# Altium schematic sheet 10_POWER.SchDoc: DCDC Power Supply / Misc.
size 381 x 266 mm; Organization: Meteroi; Address1: Room 428, 410 Guiping Rd.; Address2: Shanghai 200233, CHINA; SheetNumber: 11; SheetTotal: 11; PageSetup: Record=PageOptions|CenterHorizontal=True|CenterVertical=True|PrintScale=0.75|XCorrection=1.00|YCorrection=1.00|PrintKind=2|BorderSize=5000000|LeftOffset=0|BottomOffset=0|Orientation=2|PaperLength=1000|PaperWidth=1000|Scale=100|PaperSource=276|PrintQuality=-3|MediaType=1|DitherType=10|PaperKind=A4|PrintScaleMode=1
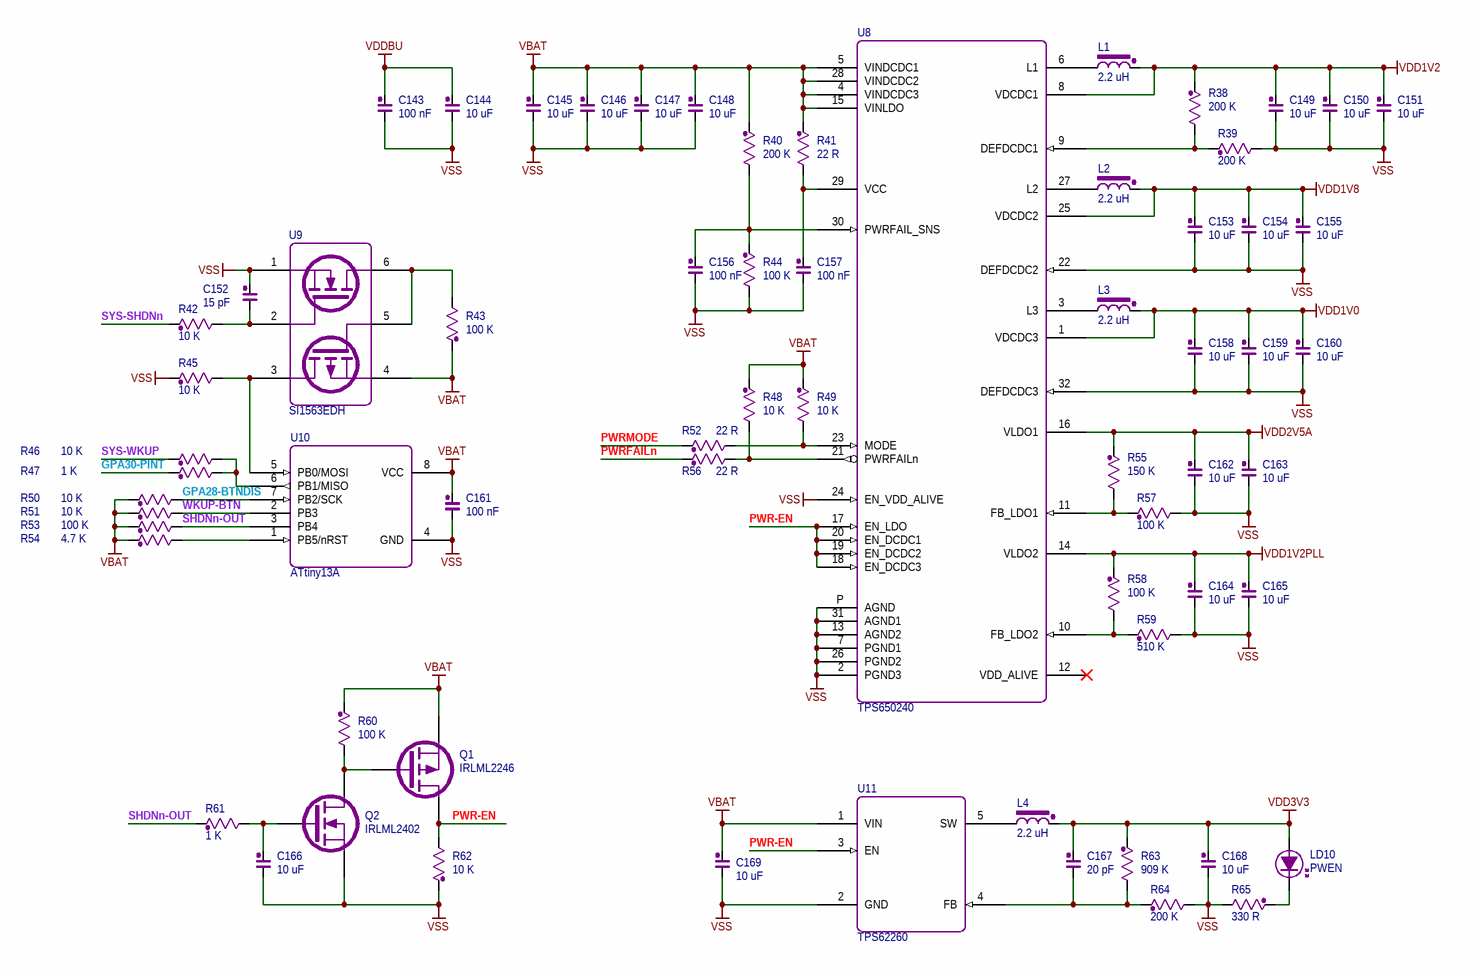
[diagram p0: 10_POWER.SchDoc]

## Parts
C143  100 nF  [0402A1]
C144  10 uF  [0603A1]
C145  10 uF  [0603A1]
C146  10 uF  [0603A1]
C147  10 uF  [0603A1]
C148  10 uF  [0603A1]
C149  10 uF  [0603A1]
C150  10 uF  [0603A1]
C151  10 uF  [0603A1]
C152  15 pF  [0402A1]
C153  10 uF  [0603A1]
C154  10 uF  [0603A1]
C155  10 uF  [0603A1]
C156  100 nF  [0402A1]
C157  100 nF  [0402A1]
C158  10 uF  [0603A1]
C159  10 uF  [0603A1]
C160  10 uF  [0603A1]
C161  100 nF  [0402A1]
C162  10 uF  [0603A1]
C163  10 uF  [0603A1]
C164  10 uF  [0603A1]
C165  10 uF  [0603A1]
C166  10 uF  [0603A1]
C167  20 pF  [0402A1]
C168  10 uF  [0603A1]
C169  10 uF  [0603A1]
L1  2.2 uH  [COIL_S_3X3]
L2  2.2 uH  [COIL_S_3X3]
L3  2.2 uH  [COIL_S_3X3]
L4  2.2 uH  [COIL_S_3X3]
LD10  PWEN  [0603LD]
Q1  IRLML2246  [SOT-23-3]
Q2  IRLML2402  [SOT-23-3]
R38  200 K  [0402A2]
R39  200 K  [0402A2]
R40  200 K  [0402A2]
R41  22 R  [0402A2]
R42  10 K  [0402A2]
R43  100 K  [0402A2]
R44  100 K  [0402A2]
R45  10 K  [0402A2]
R46  10 K  [0402A2]
R47  1 K  [0402A2]
R48  10 K  [0402A2]
R49  10 K  [0402A2]
R50  10 K  [0402A2]
R51  10 K  [0402A2]
R52  22 R  [0402A2]
R53  100 K  [0402A2]
R54  4.7 K  [0402A2]
R55  150 K  [0402A2]
R56  22 R  [0402A2]
R57  100 K  [0402A2]
R58  100 K  [0402A2]
R59  510 K  [0402A2]
R60  100 K  [0402A2]
R61  1 K  [0402A2]
R62  10 K  [0402A2]
R63  909 K  [0402A2]
R64  200 K  [0402A2]
R65  330 R  [0402A2]
U8  TPS650240  [QFN-5-32]
U9  SI1563EDH  [SOT-363]
U10  ATtiny13A  [SOIC-8W]
U11  TPS62260  [SOT-23-5]

## Nets
VBAT: C145.2 C146.2 C147.2 C148.2 C161.2 C169.2 Q1.3(S) R40.2 R41.2 R43.2 R48.2 R49.2 R50.2 R51.2 R53.2 R54.2 R60.2 U8.4(VINDCDC3) U8.5(VINDCDC1) U8.15(VINLDO) U8.28(VINDCDC2) U9.4 U10.8(VCC) U11.1(VIN)
VDD1V0: C158.2 C159.2 C160.2 L3.2 U8.1(VDCDC3)
VDD1V2: C149.2 C150.2 C151.2 L1.2 R38.2 U8.8(VDCDC1)
VDD1V2PLL: C164.2 C165.2 R58.2 U8.14(VLDO2)
VDD1V8: C153.2 C154.2 C155.2 L2.2 U8.25(VDCDC2)
VDD2V5A: C162.2 C163.2 R55.2 U8.16(VLDO1)
VDD3V3: C167.2 C168.2 L4.2 LD10.2 R63.2
VDDBU: C143.2 C144.2
VSS: C143.1 C144.1 C145.1 C146.1 C147.1 C148.1 C149.1 C150.1 C151.1 C152.2 C153.1 C154.1 C155.1 C156.1 C157.1 C158.1 C159.1 C160.1 C161.1 C162.1 C163.1 C164.1 C165.1 C166.1 C168.1 C169.1 Q2.3(S) R39.1 R44.1 R45.2 R57.1 R59.1 R62.2 R64.1 R65.1 U8.2(PGND3) U8.7(PGND1) U8.13(AGND2) U8.22(DEFDCDC2) U8.24(EN_VDD_ALIVE) U8.26(PGND2) U8.31(AGND1) U8.32(DEFDCDC3) U8.P(AGND) U9.1 U10.4(GND) U11.2(GND)
GPA28-BTNDIS: R50.1 U10.7(PB2/SCK)
GPA30-PINT: R47.2
PWR-EN: Q1.2(D) R62.1 U8.17(EN_LDO) U8.18(EN_DCDC3) U8.19(EN_DCDC2) U8.20(EN_DCDC1) U11.3(EN)
PWRFAILn: R56.2
PWRMODE: R52.2
SHDNn-OUT: R53.1 R61.2 U10.3(PB4)
SYS-SHDNn: R42.2
SYS-WKUP: R46.2
WKUP-BTN: R51.1 U10.2(PB3)
NetC152_1: C152.1 R42.1 U9.2
NetC156_2: C156.2 R40.1 R44.2 U8.30(PWRFAIL_SNS)
NetC157_2: C157.2 R41.1 U8.29(VCC)
NetC166_2: C166.2 Q2.1(G) R61.1
NetC167_1: C167.1 R63.1 R64.2 U11.4(FB)
NetL1_1: L1.1 U8.6(L1)
NetL2_1: L2.1 U8.27(L2)
NetL3_1: L3.1 U8.3(L3)
NetL4_1: L4.1 U11.5(SW)
NetLD10_1: LD10.1 R65.2
NetQ1_1: Q1.1(G) Q2.2(D) R60.1
NetR38_1: R38.1 R39.2 U8.9(DEFDCDC1)
NetR43_1: R43.1 U9.5 U9.6
NetR45_1: R45.1 U9.3 U10.5(PB0/MOSI)
NetR46_1: R46.1 R47.1 U10.6(PB1/MISO)
NetR48_1: R48.1 R56.1 U8.21(PWRFAILn)
NetR49_1: R49.1 R52.1 U8.23(MODE)
NetR54_1: R54.1 U10.1(PB5/nRST)
NetR55_1: R55.1 R57.2 U8.11(FB_LDO1)
NetR58_1: R58.1 R59.2 U8.10(FB_LDO2)

Not connected (* = marked no-connect by the designer): U8 12(VDD_ALIVE)*

## Notes on the sheet
- Title:
- Project:
- Sheet:
- Of
- Size:
- D/N:
- Rev:
- Date:
- P/N:
- S/N:
- Designer:
- C

## Library data of the parts
C143-C169 = CAP: Normal Capacitor; PartNumber: 0; Vendor: muRata; Designer: shyul; PinCountSMD: 2; SerialNumber: 0; Publisher: Cowin; PCBMarker: Capacitor; Version: 1.0; VersionDate: 04-27-2011; PinCountHole: 0
  C143 C156 C157 C161: Value: 100 nF
  C144-C151 C153-C155 C158-C160 C162-C166 C168 C169: Value: 10 uF
  C152: Value: 15 pF
  C167: Value: 20 pF
L1-L4 = COIL: Power Coil Inductor; PartNumber: LPD3015-222ML; Vendor: Coilcraft; Designer: shyul; PCBMarker: Power Inductor; SerialNumber: 0; PinCountSMD: 2; Value: 2.2 uH; Version: 1.0; VersionDate: 04-27-2011; Publisher: Cowin; PinCountHole: 0
LD10 = LED: LED Single; PartNumber: 0; Value: Red; Designer: shyul; Vendor: Luckylight; PinCountSMD: 2; Status: PWEN; Version: 1.0; Publisher: Cowin; SerialNumber: 0; VersionDate: 04-27-2011; PCBMarker: LED; PinCountHole: 0
Q1 = MOSFET_EP: P Channel Enhancement MOSFET; PartNumber: IRLML2246TRPbF; Vendor: ONSemi; Designer: shyul; SerialNumber: 0; PinCountSMD: 3; Value: IRLML2246; Version: 0.1; VersionDate: 04-28-2011; Publisher: Cowin; PCBMarker: MOSFET; PinCountHole: 0
Q2 = MOSFET_EN: N Channel Enhancement MOSFET; PartNumber: IRLML2402GPbF; SerialNumber: 0; Designer: shyul; Vendor: ONSemi; PinCountSMD: 3; Publisher: Cowin; Value: IRLML2402; PCBMarker: MOSFET; Version: 0.1; VersionDate: 04-28-2011; PinCountHole: 0
R38-R65 = RES: Normal Resistor; PartNumber: 0; Vendor: KOA; Designer: shyul; PinCountSMD: 2; SerialNumber: 0; Version: 1.0; VersionDate: 04-27-2011; PCBMarker: Resistor; Publisher: Cowin; PinCountHole: 0
  R38-R40 R64: Value: 200 K
  R41 R52 R56: Value: 22 R
  R42 R45 R46 R48-R51 R62: Value: 10 K
  R43 R44 R53 R57 R58 R60: Value: 100 K
  R47 R61: Value: 1 K
  R54: Value: 4.7 K
  R55: Value: 150 K
  R59: Value: 510 K
  R63: Value: 909 K
  R65: Value: 330 R
U8 = TPS650240: Embedded Power Management IC; PartNumber: TPS650240RHBT; SerialNumber: 0; PinCountSMD: 33; PCBMarker: PMU; Designer: shyul; Vendor: TI; PinCountHole: 0; Publisher: Cowin; Version: 1.0; VersionDate: 05-09-2011; Value: TPS650240; Supplier 1: Digi-Key; Supplier Part Number 1: 296-22475-2-ND
U9 = SI1563EDH: Complementary MOSFET; Vendor: VISHAY; SerialNumber: 0; PCBMarker: FET COMP; PinCountSMD: 6; Designer: shyul; PartNumber: SI1563EDH; Value: SI1563EDH; Version: 1.0; VersionDate: 02-21-2012; Publisher: Cowin; PinCountHole: 0
U10 = ATtiny13A: Atmel SPI Flash; PartNumber: ATtiny13A-SH; Vendor: Microchip; SerialNumber: 0; PinCountSMD: 8; Designer: shyul; Value: ATtiny13A; Version: 1.0; VersionDate: 05-26-2012; PCBMarker: SPI Flash; Publisher: Cowin; PinCountHole: 0
U11 = TPS62260: Simple Switch 600mA Adjustable; PartNumber: TPS62260DDCR; Vendor: TI; PinCountSMD: 5; PinCountHole: 0; Designer: shyul; PCBMarker: Power; Value: TPS62260; Version: 1.0; VersionDate: 05-08-2011; SerialNumber: 0; Publisher: Cowin; Supplier 1: Digi-Key; Supplier Part Number 1: 296-22469-2-ND